# Altium schematic sheet switch.SchDoc
size A4; SheetNumber: 2; SheetTotal: 4
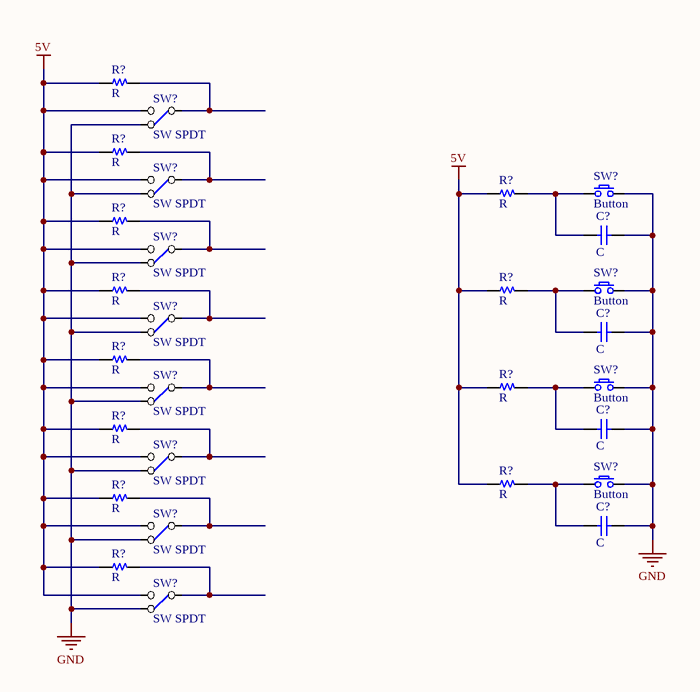
[diagram p0: switch.SchDoc]

## Parts
(Parts that share a designator on the sheet are numbered #1, #2 ... from top to bottom, then left to right.)
C?#1  C  [C 0603]
C?#2  C  [C 0603]
C?#3  C  [C 0603]
C?#4  C  [C 0603]
R?#1  R  [R 0603]
R?#2  R  [R 0603]
R?#3  R  [R 0603]
R?#4  R  [R 0603]
R?#5  R  [R 0603]
R?#6  R  [R 0603]
R?#7  R  [R 0603]
R?#8  R  [R 0603]
R?#9  R  [R 0603]
R?#10  R  [R 0603]
R?#11  R  [R 0603]
R?#12  R  [R 0603]
SW?#1  SW SPDT  [SW/3/SPDT/SS12D10]
SW?#2  Button  [SW/4/SMD/XS]
SW?#3  SW SPDT  [SW/3/SPDT/SS12D10]
SW?#4  SW SPDT  [SW/3/SPDT/SS12D10]
SW?#5  Button  [SW/4/SMD/XS]
SW?#6  SW SPDT  [SW/3/SPDT/SS12D10]
SW?#7  Button  [SW/4/SMD/XS]
SW?#8  SW SPDT  [SW/3/SPDT/SS12D10]
SW?#9  Button  [SW/4/SMD/XS]
SW?#10  SW SPDT  [SW/3/SPDT/SS12D10]
SW?#11  SW SPDT  [SW/3/SPDT/SS12D10]
SW?#12  SW SPDT  [SW/3/SPDT/SS12D10]

## Nets
5V: R?#1.1 R?#2.1 R?#3.1 R?#4.1 R?#5.1 R?#6.1 R?#7.1 R?#8.1 R?#9.1 R?#10.1 R?#11.1 R?#12.1 SW?#1.3(NO1) SW?#3.3(NO1) SW?#4.3(NO1) SW?#6.3(NO1) SW?#8.3(NO1) SW?#10.3(NO1) SW?#11.3(NO1) SW?#12.3(NO1)
GND: C?#1.2 C?#2.2 C?#3.2 C?#4.2 SW?#1.1(NC1) SW?#2.2 SW?#3.1(NC1) SW?#4.1(NC1) SW?#5.2 SW?#6.1(NC1) SW?#7.2 SW?#8.1(NC1) SW?#9.2 SW?#10.1(NC1) SW?#11.1(NC1) SW?#12.1(NC1)
NetC?#1_1: C?#1.1 R?#3.2 SW?#2.1
NetC?#2_1: C?#2.1 R?#6.2 SW?#5.1
NetC?#3_1: C?#3.1 R?#8.2 SW?#7.1
NetC?#4_1: C?#4.1 R?#10.2 SW?#9.1
NetR?#1_2: R?#1.2 SW?#1.2(COMMON1)
NetR?#2_2: R?#2.2 SW?#3.2(COMMON1)
NetR?#4_2: R?#4.2 SW?#4.2(COMMON1)
NetR?#5_2: R?#5.2 SW?#6.2(COMMON1)
NetR?#7_2: R?#7.2 SW?#8.2(COMMON1)
NetR?#9_2: R?#9.2 SW?#10.2(COMMON1)
NetR?#11_2: R?#11.2 SW?#11.2(COMMON1)
NetR?#12_2: R?#12.2 SW?#12.2(COMMON1)

## Library data of the parts
C?#1-C?#4 = Capacitor NP: Capacitor non-pol
R?#1-R?#12 = Resistor
SW?#2 SW?#5 SW?#7 SW?#9 = SW SPST: Tact switch 2 pin